# EAGLE design rpi2_relay2 (EAGLE 8.1.0)
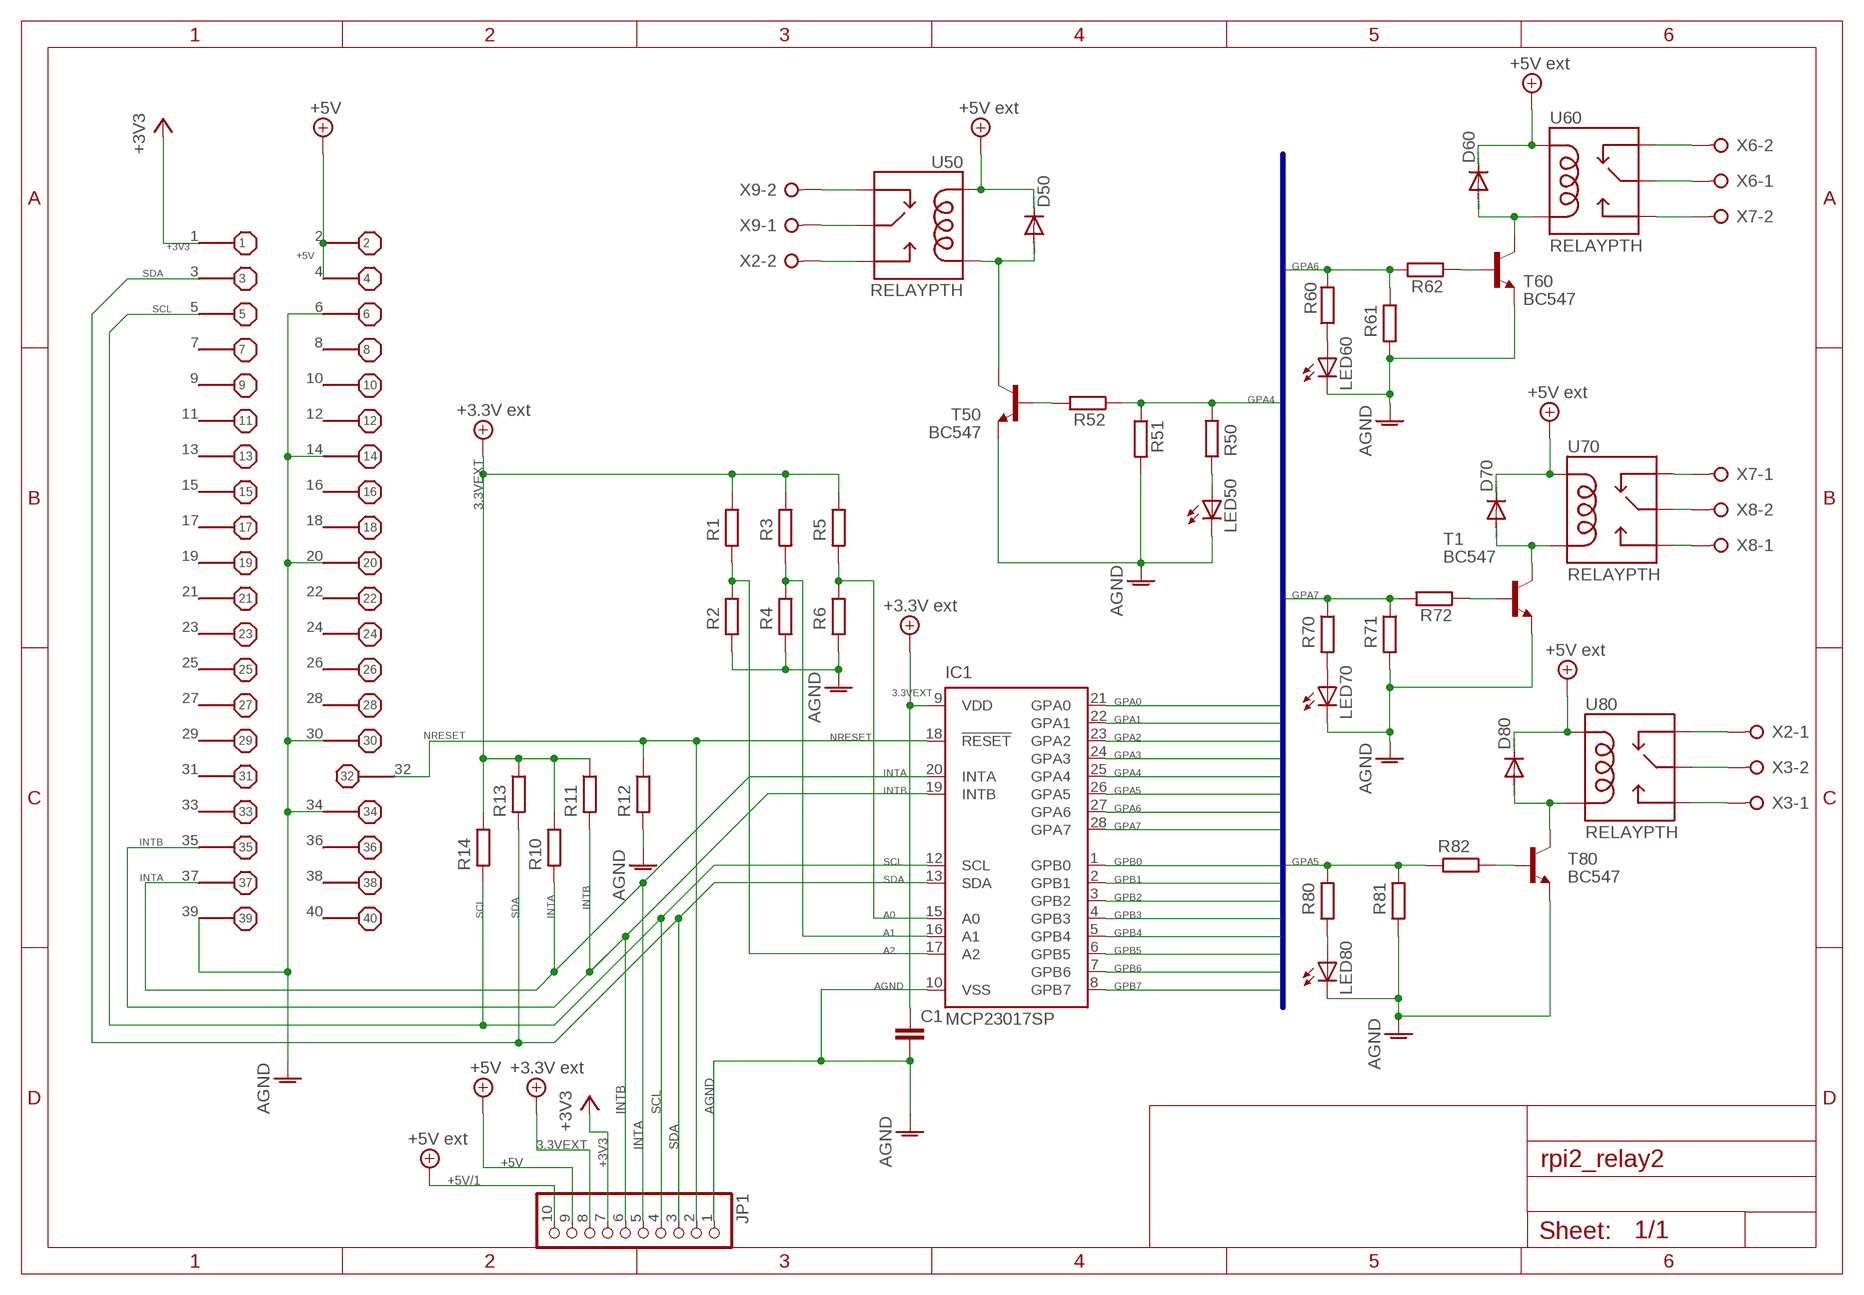
[diagram p0: schematic, sheet 1]

## Parts
C1  C-EUC1210  [C1210]
D50  1N4148DO35-7  [DO35-7]
D60  1N4148DO35-7  [DO35-7]
D70  1N4148DO35-7  [DO35-7]
D80  1N4148DO35-7  [DO35-7]
IC1  MCP23017SP  [DIL28-3]
JP1  PINHD-1X10  [1X10]
LED50  LEDCHIP-LED0805  [CHIP-LED0805]
LED60  LEDCHIP-LED0805  [CHIP-LED0805]
LED70  LEDCHIP-LED0805  [CHIP-LED0805]
LED80  LEDCHIP-LED0805  [CHIP-LED0805]
R1  R-EU_R0805  [R0805]
R2  R-EU_R0805  [R0805]
R3  R-EU_R0805  [R0805]
R4  R-EU_R0805  [R0805]
R5  R-EU_R0805  [R0805]
R6  R-EU_R0805  [R0805]
R10  R-EU_R0805  [R0805]
R11  R-EU_R0805  [R0805]
R12  R-EU_R0805  [R0805]
R13  R-EU_R0805  [R0805]
R14  R-EU_R0805  [R0805]
R50  R-EU_R0805  [R0805]
R51  R-EU_R0805  [R0805]
R52  R-EU_R0805  [R0805]
R60  R-EU_R0805  [R0805]
R61  R-EU_R0805  [R0805]
R62  R-EU_R0805  [R0805]
R70  R-EU_R0805  [R0805]
R71  R-EU_R0805  [R0805]
R72  R-EU_R0805  [R0805]
R80  R-EU_R0805  [R0805]
R81  R-EU_R0805  [R0805]
R82  R-EU_R0805  [R0805]
T1  BC547  [TO92]
T50  BC547  [TO92]
T60  BC547  [TO92]
T80  BC547  [TO92]
U50  RELAYPTH  [SRD-05VDC-SL-C]
U60  RELAYPTH  [SRD-05VDC-SL-C]
U70  RELAYPTH  [SRD-05VDC-SL-C]
U80  RELAYPTH  [SRD-05VDC-SL-C]
X1  B+_GPIO  [B+_GPIO]
X2  W237-02P  [W237-132]
X3  W237-02P  [W237-132]
X6  W237-02P  [W237-132]
X7  W237-02P  [W237-132]
X8  W237-02P  [W237-132]
X9  W237-02P  [W237-132]

## Nets
3.3VEXT: C1.1 IC1.9(VDD) JP1.8 R1.1 R3.1 R5.1 R10.1 R11.1 R13.1 R14.1 ; supply symbol labelled +3.3V ext
+3V3: JP1.7 X1.1
+5V: JP1.9 X1.2 X1.4
+5V/1: D50.C D60.C D70.C D80.C JP1.10 U50.COIL1 U60.COIL1 U70.COIL1 U80.COIL1 ; supply symbol labelled +5V ext
A0: IC1.15(A0) R5.2 R6.1
A1: IC1.16(A1) R3.2 R4.1
A2: IC1.17(A2) R1.2 R2.1
AGND: C1.2 IC1.10(VSS) JP1.1 LED50.C LED60.C LED70.C LED80.C R2.2 R4.2 R6.2 R12.2 R51.2 R61.2 R71.2 R81.2 T1.1(E) T50.1(E) T60.1(E) T80.1(E) X1.6 X1.14 X1.20 X1.30 X1.34 X1.39
GPA0: IC1.21(GPA0)
GPA1: IC1.22(GPA1)
GPA2: IC1.23(GPA2)
GPA3: IC1.24(GPA3)
GPA4: IC1.25(GPA4) R50.2 R51.1 R52.1
GPA5: IC1.26(GPA5) R80.1 R81.1 R82.2
GPA6: IC1.27(GPA6) R60.2 R61.1 R62.2
GPA7: IC1.28(GPA7) R70.1 R71.1 R72.2
GPB0: IC1.1(GPB0)
GPB1: IC1.2(GPB1)
GPB2: IC1.3(GPB2)
GPB3: IC1.4(GPB3)
GPB4: IC1.5(GPB4)
GPB5: IC1.6(GPB5)
GPB6: IC1.7(GPB6)
GPB7: IC1.8(GPB7)
INTA: IC1.20(INTA) JP1.5 R10.2 X1.37
INTB: IC1.19(INTB) JP1.6 R11.2 X1.35
N$1: LED50.A R50.1
N$2: D60.A T60.3(C) U60.COIL0
N$3: LED60.A R60.1
N$4: LED70.A R70.2
N$5: LED80.A R80.2
N$8: R72.1 T1.2(B)
N$9: U60.SWCOMMON X6.1
N$10: U60.SWCLOSED(SWCLOSE) X6.2
N$11: U60.SWOPEN X7.2
N$12: D70.A T1.3(C) U70.COIL0
N$14: U70.SWCLOSED(SWCLOSE) X7.1
N$15: U70.SWOPEN X8.1
N$16: U70.SWCOMMON X8.2
N$17: D80.A T80.3(C) U80.COIL0
N$18: R82.1 T80.2(B)
N$19: U80.SWCOMMON X3.2
N$20: U80.SWOPEN X3.1
N$21: U80.SWCLOSED(SWCLOSE) X2.1
N$22: D50.A T50.3(C) U50.COIL0
N$24: U50.SWCOMMON X9.1
N$25: U50.SWOPEN X2.2
N$26: U50.SWCLOSED(SWCLOSE) X9.2
N$27: R52.2 T50.2(B)
N$28: R62.1 T60.2(B)
NRESET: IC1.18(!RESET) JP1.2 R12.1 X1.32
SCL: IC1.12(SCL) JP1.4 R14.2 X1.5
SDA: IC1.13(SDA) JP1.3 R13.2 X1.3
Unconnected: X1.7 X1.8 X1.9 X1.10 X1.11 X1.12 X1.13 X1.15 X1.16 X1.17 X1.18 X1.19 X1.21 X1.22 X1.23 X1.24 X1.25 X1.26 X1.27 X1.28 X1.29 X1.31 X1.33 X1.36 X1.38 X1.40

## Buses
GPA[0..7],GPB[0..7]

## Library data of the parts
C1 = rcl:C-EU: CAPACITOR, European symbol
D50 D60 D70 D80 = diode:1N4148: DIODE high speed (Philips)
IC1 = microchip:MCP23017: http://ww1.microchip.com/downloads/en/DeviceDoc/21952a.pdf Source: http://ww1.microchip.com/downloads/en/DeviceDoc/21952a.pdf; MF: MICROCHIP; MPN: MCP23017-E/SP; OC_FARNELL: 1332088; OC_NEWARK: 31K2959
JP1 = pinhead:PINHD-1X10: PIN HEADER
LED50 LED60 LED70 LED80 = led:LED: LED OSRAM: - CHIPLED LG R971, LG N971, LY N971, LG Q971, LY Q971, LO R971, LY R971 LH N974, LH R974 LS Q976, LO Q976, LY Q976 LO Q996 - Hyper CHIPLED LW Q18S LB Q993, LB Q99A, LB R99A - SideLED LS A670, LO A670, LY A670, LG A670, LP A670 LB A673, LV A673, LT A673, LW A673 LH A674 LY A675 LS A676, LA A676, LO A676, LY A676, LW A676 LS A679, LY A679, LG A679 - Hyper Micro SIDELED® LS Y876, LA Y876, LO Y876, LY Y876 LT Y87S - SmartLED LW L88C, LW L88S LB L89C, LB L89S, LG L890 LS L89K, LO L89K, LY L89K LS L896, LA L896, LO L896, LY L896 - TOPLED LS T670, LO T670, LY T670, LG T670, LP T670 LSG T670, LSP T670, LSY T670, LOP T670, LYG T670 LG T671, LOG T671, LSG T671 LB T673, LV T673, LT T673, LW T673 LH T674 LS T676, LA T676, LO T676, LY T676, LB T676, LH T676, LSB T676, LW T676 LB T67C, LV T67C, LT T67C, LS T67K, LO T67K, LY T67K, LW E67C LS E67B, LA E67B, LO E67B, LY E67B, LB E67C, LV E67C, LT E67C LW T67C LS T679, LY T679, LG T679 LS T770, LO T770, LY T770, LG T770, LP T770 LB T773, LV T773, LT T773, LW T773 LH T774 LS E675, LA E675, LY E675, LS T675 LS T776, LA T776, LO T776, LY T776, LB T776 LHGB T686 LT T68C, LB T68C - Hyper Mini TOPLED® LB M676 - Mini TOPLED Santana® LG M470 LS M47K, LO M47K, LY M47K Source: http://www.osram.convergy.de LUXEON: - LUMILED® LXK2-PW12-R00, LXK2-PW12-S00, LXK2-PW14-U00, LXK2-PW14-V00 LXK2-PM12-R00, LXK2-PM12-S00, LXK2-PM14-U00 LXK2-PE12-Q00, LXK2-PE12-R00, LXK2-PE12-S00, LXK2-PE14-T00, LXK2-PE14-U00 LXK2-PB12-K00, LXK2-PB12-L00, LXK2-PB12-M00, LXK2-PB14-N00, LXK2-PB14-P00, LXK2-PB14-Q00 LXK2-PR12-L00, LXK2-PR12-M00, LXK2-PR14-Q00, LXK2-PR14-R00 LXK2-PD12-Q00, LXK2-PD12-R00, LXK2-PD12-S00 LXK2-PH12-R00, LXK2-PH12-S00 LXK2-PL12-P00, LXK2-PL12-Q00, LXK2-PL12-R00 Source: www.luxeon.com KINGBRIGHT: KA-3528ASYC Source: www.kingbright.com
R1-R6 R10-R14 R50-R52 R60-R62 R70-R72 R80-R82 = rcl:R-EU_: RESISTOR, European symbol
T1 T50 T60 T80 = transistor:BC547: NPN TRANSISTOR
U50 U60 U70 U80 = SWI_COMMONS:RELAY: SPDT relay (COM-00101)
X1 = raspberry:B+_GPIO
X2 X3 X6-X9 = con-wago-508:W237-02P: WAGO SREW CLAMP; OC_FARNELL: unknown; OC_NEWARK: unknown

## Board
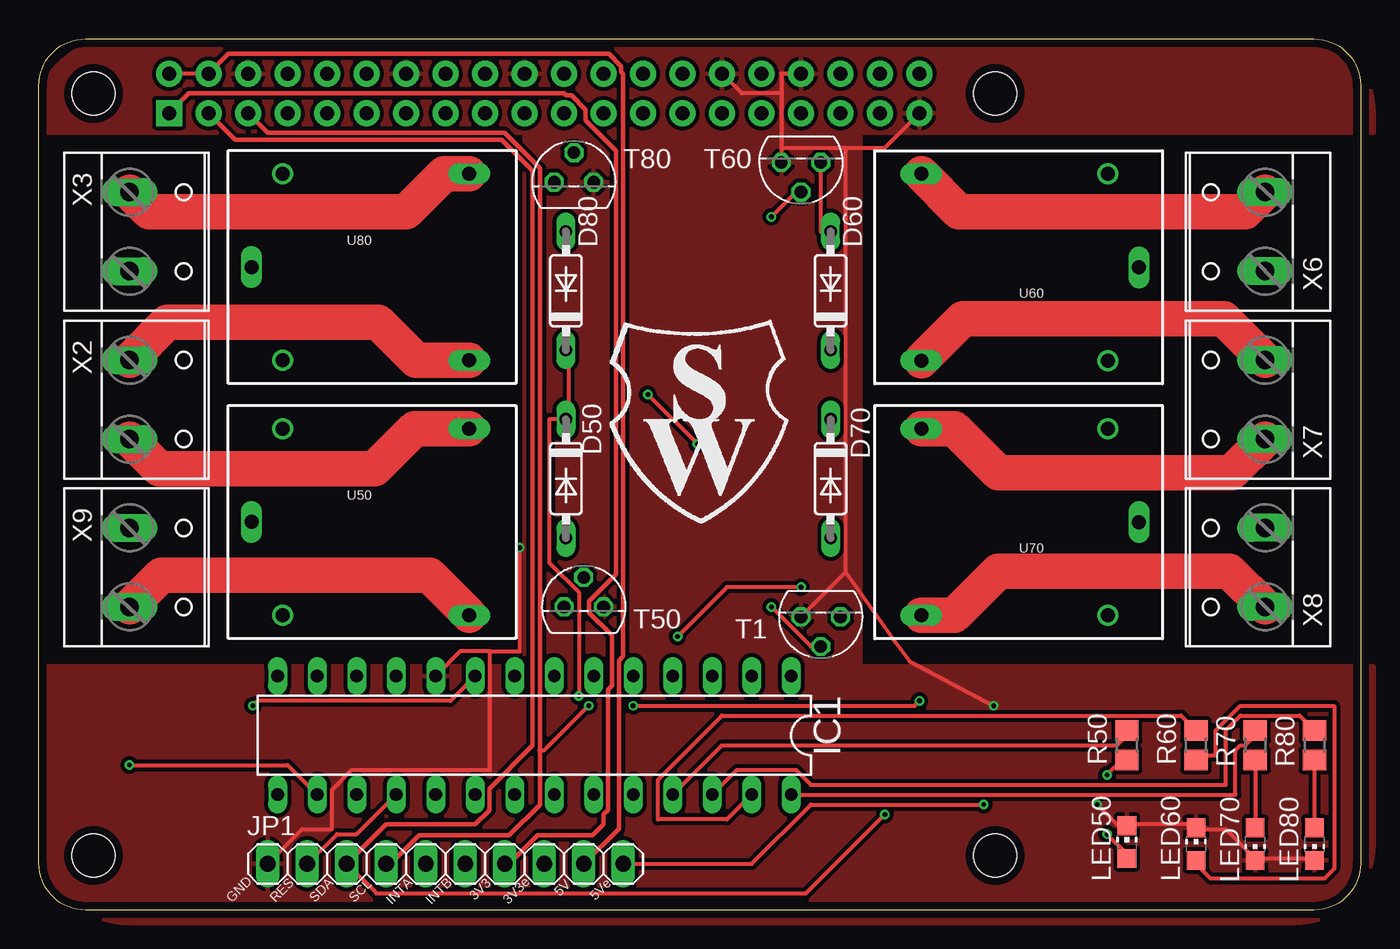
[diagram p1: board, top side]
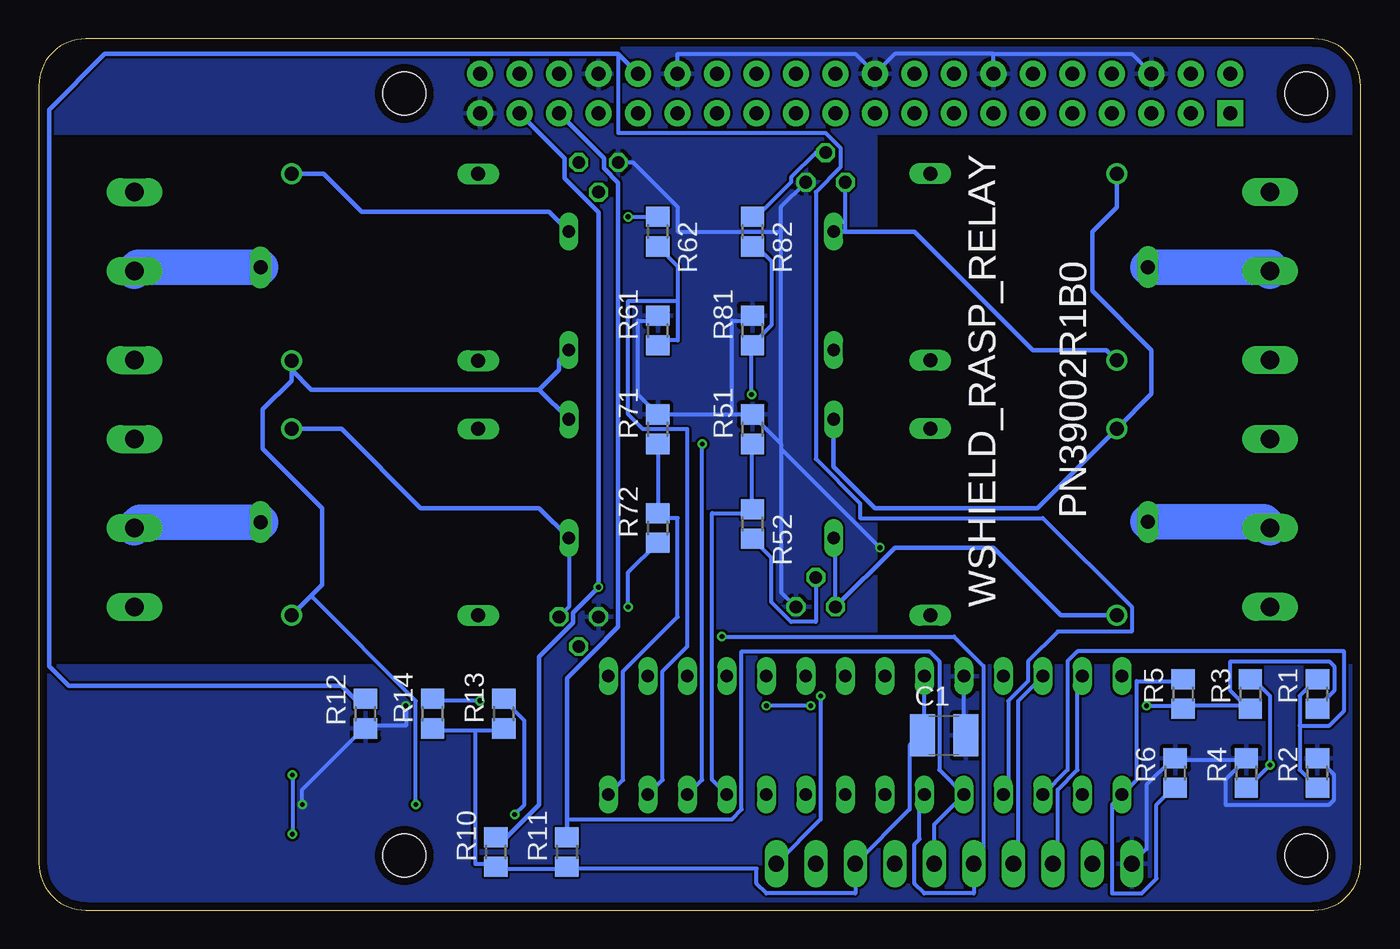
[diagram p2: board, bottom side, seen from below]

Size 85 x 56 mm. Coordinates in mm from the lower left corner, seen from the top.
Outline: 0,53 arc-90 3,56 82,56 arc-90 85,53 85,3 arc-90 82,0 3,0 arc-90 0,3 0,53
Copper layers (1*16): Top 0.035mm / dielectric 1.6mm / Bottom 0.035mm
Design rules "Elecrow_2-layer_PCB_eagle_rule *": minimum track width 10mil, minimum drill 12mil, track to track 6mil, track to pad 6mil, pad to pad 6mil, via to via 8mil, smd to smd 0mil, copper to edge 20mil, drill to drill 10mil, minimum pad ring 6mil, minimum via ring 6mil, stop-mask expansion 0mil, vias tented up to drill 100mil, thermal gap 10mil
Holes 2.75 mm at 3.5,52.5 3.5,3.5 61.5,52.5 61.5,3.5

### Footprints (pad centres in the part's own frame; a part is rotated, then mirrored left to right if it is on the bottom)
C1210 = smd 1.6 x 2.7: 1 -1.4,0; 2 1.4,0
DO35-7 = drill 0.813 long: A 3.81,0; C -3.81,0
DIL28-3 = drill 0.813 long: 1 -16.51,-3.81; 2 -13.97,-3.81; 3 -11.43,-3.81; 4 -8.89,-3.81; 5 -6.35,-3.81; 6 -3.81,-3.81; 7 -1.27,-3.81; 8 1.27,-3.81; 9 3.81,-3.81; 10 6.35,-3.81; 11 8.89,-3.81; 12 11.43,-3.81; 13 13.97,-3.81; 14 16.51,-3.81; 15 16.51,3.81; 16 13.97,3.81; 17 11.43,3.81; 18 8.89,3.81; 19 6.35,3.81; 20 3.81,3.81; 21 1.27,3.81; 22 -1.27,3.81; 23 -3.81,3.81; 24 -6.35,3.81; 25 -8.89,3.81; 26 -11.43,3.81; 27 -13.97,3.81; 28 -16.51,3.81
1X10 = drill 1.016 long: 1 -11.43,0; 2 -8.89,0; 3 -6.35,0; 4 -3.81,0; 5 -1.27,0; 6 1.27,0; 7 3.81,0; 8 6.35,0; 9 8.89,0; 10 11.43,0
CHIP-LED0805 = smd 1.2 x 1.2: A 0,-1.05; C 0,1.05
R0805 = smd 1.3 x 1.5: 1 -0.95,0; 2 0.95,0
TO92 = drill 0.813 octagon: 1 1.27,0; 2 0,1.905; 3 -1.27,0
SRD-05VDC-SL-C = drill 0.9: COIL0 -5.39,-6.12; COIL1 -5.39,5.88 | drill 0.9 long: SWCLOSED 6.61,-6.12; SWCOMMON -7.39,-0.12; SWOPEN 6.61,5.88
B+_GPIO = drill 0.9 pad 1.676 square: 1 -24.13,-1.27 | drill 0.9 pad 1.676: 2 -24.13,1.27; 3 -21.59,-1.27; 4 -21.59,1.27; 5 -19.05,-1.27; 6 -19.05,1.27; 7 -16.51,-1.27; 8 -16.51,1.27; 9 -13.97,-1.27; 10 -13.97,1.27; 11 -11.43,-1.27; 12 -11.43,1.27; 13 -8.89,-1.27; 14 -8.89,1.27; 15 -6.35,-1.27; 16 -6.35,1.27; 17 -3.81,-1.27; 18 -3.81,1.27; 19 -1.27,-1.27; 20 -1.27,1.27; 21 1.27,-1.27; 22 1.27,1.27; 23 3.81,-1.27; 24 3.81,1.27; 25 6.35,-1.27; 26 6.35,1.27; 27 8.89,-1.27; 28 8.89,1.27; 29 11.43,-1.27; 30 11.43,1.27; 31 13.97,-1.27; 32 13.97,1.27; 33 16.51,-1.27; 34 16.51,1.27; 35 19.05,-1.27; 36 19.05,1.27; 37 21.59,-1.27; 38 21.59,1.27; 39 24.13,-1.27; 40 24.13,1.27
W237-132 = drill 1.194 long: 1 -2.54,-0.635; 2 2.54,-0.635

### Placement (x,y rotation side)
C1  26.79,11.23 0 bottom
D50  33.9,27.73 270 top
D60  50.91,39.8 90 top
D70  50.91,27.73 270 top
D80  33.9,39.8 90 top
IC1  31.87,11.23 180 top
JP1  26.15,2.97 0 top
LED50  69.96,4.37 0 top
LED60  74.41,4.24 0 top
LED70  78.22,4.24 180 top
LED80  82.03,4.24 180 top
R1  2.78,13.89 90 bottom
R2  2.78,8.81 90 bottom
R3  7.1,13.89 90 bottom
R4  7.35,8.81 90 bottom
R5  11.42,13.89 90 bottom
R6  11.93,8.81 90 bottom
R10  55.61,3.73 90 bottom
R11  51.04,3.73 90 bottom
R12  64,12.62 270 bottom
R13  55.11,12.62 90 bottom
R14  59.68,12.62 90 bottom
R50  69.96,10.59 90 top
R51  39.1,30.91 90 bottom
R52  39.1,24.81 270 bottom
R60  74.41,10.59 90 top
R61  45.2,37.26 90 bottom
R62  45.2,43.61 270 bottom
R70  78.22,10.59 270 top
R71  45.2,30.91 90 bottom
R72  45.2,24.56 90 bottom
R80  82.03,10.59 270 top
R81  39.1,37.26 90 bottom
R82  39.1,43.61 270 bottom
T1  50.28,18.84 180 top
T50  35.04,19.48 0 top
T60  49.01,48.05 180 top
T80  34.41,46.79 0 top
U50  21.07,25.07 0 top
U60  63.36,41.2 180 top
U70  63.36,24.81 180 top
U80  21.07,41.45 0 top
U$1  [BRAND_SWI_10X14]  36.31,24.56 0 top
X1  32.5,52.5 0 top
X2  6.47,32.81 270 top
X3  6.47,43.61 270 top
X6  78.22,43.61 90 top
X7  78.22,32.81 90 top
X8  78.22,22.02 90 top
X9  6.47,22.02 270 top

### Tracks (layer width: path | path; a pad name or v marks a point on that pad's centre or on a via)
3.3VEXT  (via drill 0.3)
  Top 0.254: v13.77,13.13 14.09,13.45 26.47,13.45 IC1.9
  Bottom 0.254: 56.95,11.54 59.49,11.54 R14.1 | 56.95,11.54 55.36,11.54 R13.1 | 56.95,11.54 56.95,2.97 55.68,2.97 R10.1 55.36,2.65 51.23,2.65 R11.1 50.91,2.65 38.85,2.65 38.85,1.7 38.22,1.06 32.5,1.06 JP1.8 29.01,6.46 29.01,10.59 28.37,11.23 C1.1 28.05,11.23 IC1.9 | 7.42,13.13 7.1,12.81 R3.1 7.42,13.13 | 7.42,13.13 8.37,14.08 8.37,15.99 2.02,15.99 1.7,15.67 1.7,14.08 2.66,13.13 R1.1 | 7.42,13.13 11.23,13.13 R5.1 11.55,13.13 v13.77,13.13
+3V3
  Top 0.305: X1.1 9.64,52.5 33.77,52.5 33.9,52.37 34.24,52.37 35.17,51.45 35.17,50.76 37.12,48.8 37.12,21.59 35.4,19.86 35.4,19.1 36.84,17.65 36.84,14.4 36.59,14.15 36.59,6.43 36.31,6.15 36.31,5.51 35.6,4.8 32.06,4.8 30.23,2.97 JP1.7
+5V
  Top 0.254: X1.4 X1.2
  Top 0.305: X1.4 12.18,55.04 36.66,55.04 37.45,54.24 37.45,53.9 37.58,53.77 37.58,16.3 37.3,16.02 37.3,5.23 JP1.9
+5V/1  (via drill 0.3)
  Top 0.254: D80.C 34.09,35.99 34.09,31.55 D50.C 32.82,31.55 32.82,22.34 34.72,20.43 v34.72,13.77 | v60.76,6.78 49.65,6.78 45.84,2.97 JP1.10
  Bottom 0.254: JP1.10 34.72,5.83 v34.72,13.77 | 67.5,20.19 60.76,13.45 v60.76,6.78
  Bottom 0.305: 68.75,34.72 U60.COIL1 | 68.75,34.72 68.75,34.03 70.6,32.18 70.6,29.64 66.79,25.83 66.79,20.89 67.5,20.19 U70.COIL1 | D70.C 52.82,33.45 | 52.82,33.45 67.48,33.45 68.75,34.72 | 52.82,33.45 51.55,34.72 51.55,35.36 D60.C | D50.C 33.9,28.5 31.23,25.83 20.8,25.83 U50.COIL1 13.45,33.18 13.45,35.99 17.26,39.8 17.26,43.61 15.68,45.19 U80.COIL1
A0
  Bottom 0.254: R6.1 12.18,7.73 13.13,6.78 13.13,2.02 14.09,1.06 15.99,1.06 15.99,6.78 IC1.15 14.4,8.37 14.4,14.72 11.55,14.72 R5.2
A1  (via drill 0.3)
  Top 0.254: IC1.16 15.99,9.32 v5.83,9.32
  Bottom 0.254: R4.1 7.1,8.05 v5.83,9.32 5.83,13.77 7.1,15.04 R3.2
A2
  Bottom 0.254: 3.92,11.86 3.92,13.77 2.97,14.72 R1.2 | 3.92,11.86 3.92,9 2.97,8.05 R2.1 | IC1.17 18.85,9 18.85,15.99 18.21,16.62 1.07,16.62 1.07,12.81 2.02,11.86 3.92,11.86
AGND  (via drill 0.3)
  Top 0.254: IC1.10 27.1,16.62 29.01,16.62 | 29.01,16.62 30.91,16.62 v30.91,23.29 | 29.01,16.62 29.01,9 20.12,9 18.85,7.73 18.85,5.19 16.94,5.19 JP1.1 | 78.22,3.29 82.03,3.29 LED80.C | 69.96,5.51 74.41,5.51 LED60.C 74.41,5.19 76.31,5.19 78.22,3.29 | v68.06,6.78 69.33,5.51 69.96,5.51 | 69.96,5.51 LED50.C | 78.22,3.29 LED70.C | 47.74,52.5 47.74,53.77 X1.34 | 47.74,52.5 47.74,49.01 | 47.74,49.01 T60.1 | 51.87,21.7 T1.1 | 51.87,49.01 51.87,21.7 | 47.74,49.01 51.87,49.01 | X1.30 45.2,52.5 47.74,52.5 | X1.39 54.41,49.01 51.87,49.01 | v61.39,13.13 55.99,15.99 55.04,17.26 51.87,21.7
  Bottom 0.254: IC1.10 25.52,11.23 C1.2 | 7.42,9.64 8.69,8.37 8.69,6.78 2.02,6.78 1.7,7.1 1.7,8.69 2.66,9.64 R2.2 | 7.42,9.64 11.86,9.64 R6.2 12.18,9.64 13.77,8.05 13.77,3.92 JP1.1 | 7.42,9.64 R4.2 | R71.2 40.44,31.86 | 40.44,31.86 39.17,31.86 R51.2 38.85,31.55 37.26,29.96 | 40.44,31.86 40.44,37.9 39.17,37.9 R81.2 | R71.2 46.47,33.13 46.47,37.9 45.2,37.9 R61.2 | R71.2 | T50.1 37.26,20.43 37.26,29.64 | 37.26,29.96 37.26,29.64 | T80.1 37.26,45.2 37.26,43.61 | 37.26,29.96 37.26,43.61 | v68.06,6.78 68.06,7.73 64.25,11.54 R12.2 63.93,11.86 61.39,11.86 v61.39,13.13 | X1.6 14.72,55.04 23.61,55.04 | X1.14 23.61,55.04 | 23.61,55.04 29.96,55.04 X1.20 32.5,55.04 43.93,55.04 X1.30 | 37.26,43.61 43.93,43.61 43.93,45.2 46.79,48.05 T60.1 | 37.26,29.64 v30.91,23.29
  pour Bottom: -0.52,51.23 arc-90 4.56,56.31 5.83,56.31 80.76,56.31 arc-90 85.84,51.23 85.84,49.96 52.82,49.96 52.82,15.67 84.57,15.67 85.84,15.67 85.84,4.24 arc-90 80.76,-0.84 78.22,-0.84 4.56,-0.84 arc-90 -0.52,4.24 -0.52,15.67 31.23,15.67 31.23,19.48 31.23,49.96 -0.52,49.96
  pour Top (isolate 0.254): -0.52,49.96 arc-90 5.83,56.31 7.1,56.31 80.76,56.31 arc-90 85.84,51.23 85.84,49.96 52.82,49.96 52.82,15.67 85.84,15.67 85.84,4.24 arc-90 80.76,-0.84 5.83,-0.84 arc-90 -0.52,5.51 -0.52,15.67 31.23,15.67 31.23,49.96
GPA4
  Top 0.254: IC1.25 43.93,10.59 69.33,10.59 69.96,11.23 R50.2
  Bottom 0.254: R51.1 39.17,29.96 39.17,25.83 R52.1 39.17,25.51 41.71,25.51 41.71,8.37 IC1.25
GPA5  (via drill 0.3)
  Top 0.254: IC1.26 44.88,9 48.69,9 49.65,8.05 76.31,8.05 76.31,11.54 77.27,12.5 81.08,12.5 R80.1 | v42.34,29.96 v39.17,33.13
  Bottom 0.254: R82.2 38.85,42.66 37.9,41.7 37.9,37.58 38.85,36.62 R81.1 39.17,36.31 v39.17,33.13 | v42.34,29.96 42.34,8.37 IC1.26
GPA6
  Top 0.254: IC1.27 44.25,5.83 39.8,5.83 39.8,8.37 43.93,12.5 73.46,12.5 R60.2
  Bottom 0.254: 43.93,39.16 43.93,41.39 R62.2 | 43.93,39.16 43.93,36.62 45.2,36.62 R61.1 | 43.93,39.16 47.11,39.16 47.11,31.86 46.15,30.91 43.3,30.91 43.3,16.94 44.88,15.35 44.88,8.37 IC1.27
GPA7
  Top 0.254: IC1.28 76.95,7.42 76.95,10.27 77.27,10.59 77.58,10.59 78.22,11.23 R70.1
  Bottom 0.254: R71.1 R72.2 45.2,25.2 43.93,25.2 43.93,18.84 47.42,15.35 47.42,8.37 IC1.28
INTA  (via drill 0.3)
  Top 0.254: v41.07,17.57 44.25,20.75 v49.01,20.75
  Bottom 0.254: IC1.20 28.37,7.1 28.37,4.56 28.69,4.24 28.69,1.7 28.05,1.06 24.88,1.06 JP1.5 24.25,3.6 24.25,15.67 26.15,17.57 v41.07,17.57
  Bottom 0.305: X1.37 51.19,48.33 51.19,47.04 49.01,44.86 v49.01,20.75 50.64,19.12 50.64,18.47 52.82,16.28 52.82,6.78 54.92,4.68 R10.2
INTB
  Bottom 0.254: JP1.6 27.42,5.51 IC1.19 27.1,9 27.1,15.99 27.74,16.62 39.8,16.62 39.8,6.46 40.44,5.83 51.04,5.83
  Bottom 0.305: X1.35 48.65,48.33 48.65,47.68 47.74,46.76 47.74,18.21 49.37,16.58 49.37,16.56 51.04,14.89 51.04,5.83 R11.2
N$1  (via drill 0.3)
  Top 0.254: v68.69,4.88 69.96,3.6 LED50.A | v68.69,8.69 69.65,9.64 R50.1
  Bottom 0.254: v68.69,8.69 v68.69,4.88
N$2
  Top 0.254: T60.3 50.28,43.61 D60.A
  Bottom 0.305: U60.COIL0 66.69,47.32 64.25,44.88 52.19,44.88 D60.A
N$3
  Top 0.254: LED60.A 74.41,2.97 75.36,2.02 82.66,2.02 83.3,2.65 83.3,13.13 77.27,13.13 75.68,11.54 75.68,9.96 74.41,9.96 R60.1
N$4
  Top 0.254: R70.2 LED70.A
N$5
  Top 0.254: R80.2 LED80.A
N$8  (via drill 0.3)
  Top 0.254: v47.11,19.48 49.65,16.94 T1.2
  Bottom 0.254: v47.11,19.48 47.11,21.7 R72.1
N$9
  Bottom 2.286: U60.SWCOMMON 78.61,41.32 X6.1
N$10
  Top 2.286: X6.2 77.58,44.88 59.17,44.88 59.17,44.9 U60.SWCLOSED
N$11
  Top 2.286: U60.SWOPEN 56.75,35.35 59.42,38.02 76.19,38.02 X7.2
N$12
  Bottom 0.254: T1.3 50.91,19.48 D70.A
  Bottom 0.305: U70.COIL0 65.54,30.93 60.44,25.83 52.82,25.83 D70.A
N$14
  Top 2.286: U70.SWCLOSED 58.89,30.93 61.71,28.12 76.7,28.12 X7.1
N$15
  Top 2.286: U70.SWOPEN 58.88,18.93 61.71,21.77 76.57,21.77 X8.1
N$16
  Bottom 2.286: U70.SWCOMMON 78.48,24.93 X8.2
N$17
  Bottom 0.254: 33.13,43.61 T80.3
  Bottom 0.305: D80.A 33.13,43.61 28.69,43.61 21.07,35.99 16.34,35.99 U80.COIL0
N$18
  Bottom 0.254: T80.2 35.04,48.69 36.63,47.1 36.63,46.79 38.85,44.56 R82.1
N$19
  Bottom 2.286: U80.SWCOMMON 5.83,41.33 X3.2
N$20
  Top 2.286: U80.SWOPEN 26.06,47.33 23.61,44.88 7.1,44.88 X3.1
N$21
  Top 2.286: U80.SWCLOSED 24.27,35.33 21.83,37.77 8.24,37.77 X2.1
N$22
  Bottom 0.254: D50.A 33.77,23.93 T50.3
  Bottom 0.305: U50.COIL0 19.27,18.95 23.61,23.29 29.96,23.29 T50.3
N$24
  Bottom 2.286: U50.SWCOMMON 6.22,24.95 X9.1
N$25
  Top 2.286: U50.SWOPEN 24.16,30.95 21.58,28.37 7.74,28.37 X2.2
N$26
  Top 2.286: U50.SWCLOSED 27.68,18.97 25.13,21.51 7.86,21.51 X9.2
N$27
  Bottom 0.254: T50.2 35.04,18.53 36.63,18.53 37.9,19.8 37.9,22.66 38.85,23.61 R52.2
N$28  (via drill 0.3)
  Top 0.254: v47.11,44.56 48.69,46.15 T60.2
  Bottom 0.254: v47.11,44.56 R62.1
NRESET
  Top 0.254: IC1.18 20.44,4.88 19.16,4.88 JP1.2
  Bottom 0.254: IC1.18 22.66,7.73 22.66,13.45 21.39,14.72 21.39,15.99 19.48,17.89 14.72,17.89 14.72,19.48 20.44,25.2 32.18,25.2 32.18,26.15 35.04,29 35.04,46.15 33.45,47.74 33.45,49.01 34.41,49.96 47.74,49.96 47.74,55.04
  Bottom 0.305: X1.32 47.74,55.04 80.76,55.04 84.34,51.46 84.34,15.67 83.07,14.4 65.52,14.4 64.69,13.57 R12.1
SCL  (via drill 0.3)
  Top 0.254: v56.63,13.45 56.31,13.13 v38.22,13.13 | v35.36,13.13 32.5,10.27 32.22,10.27 32.18,10.27
  Top 0.305: X1.5 14.72,49.96 29.96,49.96 32.22,47.7 32.22,10.27 32.22,6.78 30.24,4.8 24.44,4.8 22.61,2.97 JP1.4
  Bottom 0.254: v56.63,13.45 59.49,13.45 R14.2 | v35.36,13.13 v38.22,13.13 | IC1.12 22.02,13.45 22.02,3.29 JP1.4
SDA  (via drill 0.3)
  Top 0.254: v54.41,6.15 49.33,1.06 21.71,1.06 JP1.3
  Top 0.305: X1.3 12.64,49.5 29.77,49.5 31.76,47.51 31.76,10.59 28.97,7.8 28.97,6.43 28.05,5.51 22.34,5.51 JP1.3
  Bottom 0.254: v54.41,6.15 53.77,6.78 53.77,12.18 55.04,13.45 R13.2 | IC1.13 18.21,14.72 18.21,9 19.48,7.73 19.48,3.29 JP1.3

### Text on the board
tNames: GND | RES | SDA | SCL | 3V3 | 5V | 5Ve | INTA | INTB | 3V3e
bNames: PN39002R1B0 | WSHIELD_RASP_RELAY